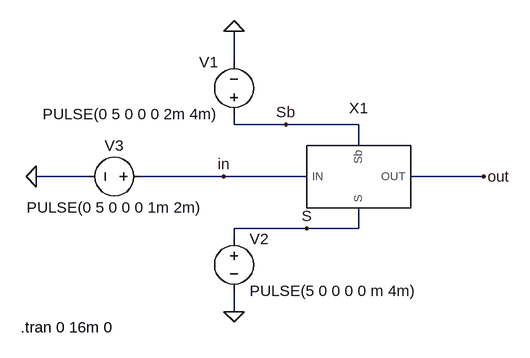
[diagram p0: schematic TG_TB.asc]
TG_TB.asc, the LTspice schematic file:
Version 4
SHEET 1 880 680
WIRE 0 0 0 -48
WIRE 0 96 0 80
WIRE 80 96 0 96
WIRE 192 96 80 96
WIRE 192 128 192 96
WIRE -224 176 -304 176
WIRE -16 176 -144 176
WIRE 112 176 -16 176
WIRE 384 176 272 176
WIRE 112 256 0 256
WIRE 192 256 192 224
WIRE 192 256 112 256
WIRE 0 272 0 256
WIRE 0 384 0 352
FLAG 384 176 out
FLAG 0 -48 0
FLAG 0 384 0
FLAG -304 176 0
FLAG 80 96 Sb
FLAG 112 256 S
FLAG -16 176 in
SYMBOL TG 192 176 R0
SYMATTR InstName X1
SYMBOL voltage 0 96 R180
WINDOW 0 24 96 Left 2
WINDOW 3 24 16 Left 2
WINDOW 123 0 0 Left 0
WINDOW 39 0 0 Left 0
SYMATTR InstName V1
SYMATTR Value PULSE(0 5 0 0 0 2m 4m)
SYMBOL voltage 0 256 R0
WINDOW 123 0 0 Left 0
WINDOW 39 0 0 Left 0
SYMATTR InstName V2
SYMATTR Value PULSE(5 0 0 0 0 m 4m)
SYMBOL voltage -128 176 R90
WINDOW 0 -32 56 VBottom 2
WINDOW 3 32 56 VTop 2
WINDOW 123 0 0 Left 0
WINDOW 39 0 0 Left 0
SYMATTR InstName V3
SYMATTR Value PULSE(0 5 0 0 0 1m 2m)
TEXT -328 408 Left 2 !.tran 0 16m 0

The netlist it stands for:
* TG_TB.asc
XX1 S Sb in out TG  ; pins S Sb IN OUT
V1 Sb 0 PULSE(0 5 0 0 0 2m 4m)
V2 S 0 PULSE(5 0 0 0 0 m 4m)
V3 in 0 PULSE(0 5 0 0 0 1m 2m)
.tran 0 16m 0
.backanno
.end